# Altium schematic sheet llrf_afe_fpga_conf.SchDoc: =GlobalProjectName
size 209 x 297 mm; SheetNumber: Лист; SheetTotal: Листов; PageSetup: Record=PageOptions|CenterHorizontal=True|CenterVertical=True|PrintScale=1.00|XCorrection=1.00|YCorrection=1.00|PrintKind=1|BorderSize=5000000|LeftOffset=0|BottomOffset=0|Orientation=2|PaperLength=1000|PaperWidth=1000|Scale=100|PaperSource=15|PrintQuality=1200|MediaType=1|DitherType=10|PaperKind=A3|PrintScaleMode=1; Weight: -; ScaleFactor: -
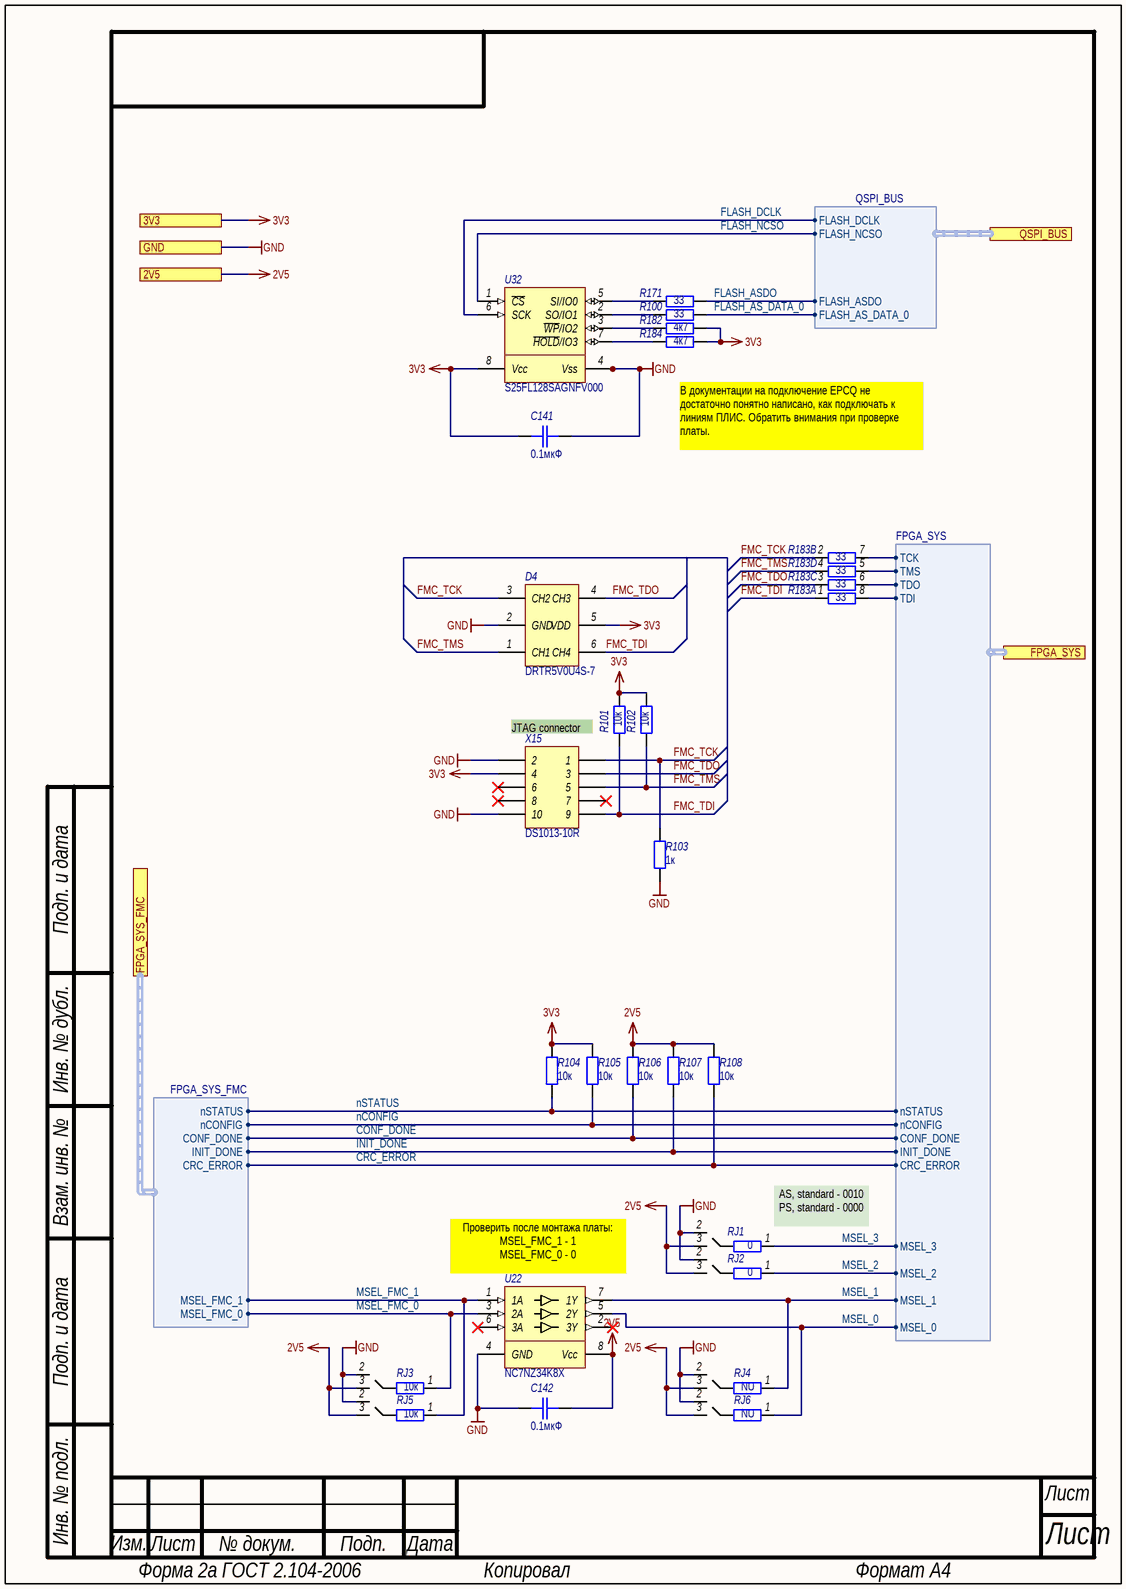
[diagram p0: llrf_afe_fpga_conf.SchDoc]

## Parts
C141  0.1мкФ  [SMD_C0402]
C142  0.1мкФ  [SMD_C0402]
D4  Наименование: DRTR5V0U4S-7  [SOT-363]  (hidden comment: DRTR5V0U4S)
R100  33  [SMD_0603]
R101  10к  [SMD_0603]
R102  10к  [SMD_0603]
R103  1к  [SMD_0603]
R104  10к  [SMD_0603]
R105  10к  [SMD_0603]
R106  10к  [SMD_0603]
R107  10к  [SMD_0603]
R108  10к  [SMD_0603]
R171  33  [SMD_0603]
R182  4к7  [SMD_0603]
R183  value 33  [TC124]  (hidden comment: 4 Chip Resistor Array)  (parts A,B,C,D of 4)
R184  4к7  [SMD_0603]
RJ1  0  [SMD_JMP_0603]
RJ2  0  [SMD_JMP_0603]
RJ3  10к  [SMD_JMP_0603]
RJ4  NU  [SMD_JMP_0603]
RJ5  10к  [SMD_JMP_0603]
RJ6  NU  [SMD_JMP_0603]
U22  Наименование: NC7NZ34K8X  [US-8]  (hidden comment: NC7NZ34)
U32  Наименование: S25FL128SAGNFV000  [WSON-8_6x8]  (hidden comment: S25FL128SAGN)
X15  DS1013-10R  [DS1013-10R]

## Ports
2V5, 3V3, FPGA_SYS (harness FPGA_SYS), FPGA_SYS_FMC (harness FPGA_SYS_FMC), GND, QSPI_BUS (harness QSPI_BUS)

## Harnesses
QSPI_BUS: FLASH_ASDO, FLASH_NCSO, FLASH_DCLK, FLASH_AS_DATA_0
FPGA_SYS: TCK, TMS, TDO, TDI, CRC_ERROR, INIT_DONE, nSTATUS, CONF_DONE, nCONFIG, MSEL_0, MSEL_1, MSEL_2, MSEL_3
FPGA_SYS_FMC: INIT_DONE, nSTATUS, CONF_DONE, nCONFIG, MSEL_FMC_0, MSEL_FMC_1, CRC_ERROR

## Nets
2V5: C142.2 R106.2 R107.2 R108.2 RJ1.3 RJ2.3 RJ3.3 RJ4.3 RJ5.3 RJ6.3 U22.8(Vcc) ; port 2V5
3V3: C141.2 D4.5(VDD) R101.2 R102.2 R104.2 R105.2 R182.1 R184.1 U32.8(Vcc) X15.4 ; port 3V3
GND: C141.1 C142.1 D4.2(GND) R103.1 RJ1.2 RJ2.2 RJ3.2 RJ4.2 RJ5.2 RJ6.2 U22.4(GND) U32.4(Vss) U32.9(TP) X15.2 X15.10 ; port GND
CONF_DONE: R106.1 ; port FPGA_SYS.CONF_DONE, port FPGA_SYS_FMC.CONF_DONE
CRC_ERROR: R108.1 ; port FPGA_SYS.CRC_ERROR, port FPGA_SYS_FMC.CRC_ERROR
FLASH_AS_DATA_0: R100.2 ; port QSPI_BUS.FLASH_AS_DATA_0
FLASH_ASDO: R171.2 ; port QSPI_BUS.FLASH_ASDO
FLASH_DCLK: U32.6(SCK) ; port QSPI_BUS.FLASH_DCLK
FLASH_NCSO: U32.1(~{CS}) ; port QSPI_BUS.FLASH_NCSO
FMC_TCK: D4.3(СH2) R103.2 R183.2 X15.1
FMC_TDI: D4.6(СH4) R101.1 R183.1 X15.9
FMC_TDO: D4.4(СH3) R183.3 X15.3
FMC_TMS: D4.1(СH1) R102.1 R183.4 X15.5
INIT_DONE: R107.1 ; port FPGA_SYS.INIT_DONE, port FPGA_SYS_FMC.INIT_DONE
MSEL_0: RJ6.1 U22.5(2Y) ; port FPGA_SYS.MSEL_0
MSEL_1: RJ4.1 U22.7(1Y) ; port FPGA_SYS.MSEL_1
MSEL_2: RJ2.1 ; port FPGA_SYS.MSEL_2
MSEL_3: RJ1.1 ; port FPGA_SYS.MSEL_3
MSEL_FMC_0: RJ3.1 U22.3(2A) ; port FPGA_SYS_FMC.MSEL_FMC_0
MSEL_FMC_1: RJ5.1 U22.1(1A) ; port FPGA_SYS_FMC.MSEL_FMC_1
nCONFIG: R105.1 ; port FPGA_SYS.nCONFIG, port FPGA_SYS_FMC.nCONFIG
nSTATUS: R104.1 ; port FPGA_SYS.nSTATUS, port FPGA_SYS_FMC.nSTATUS
NetR100_1: R100.1 U32.2(SO/IO1)
NetR171_1: R171.1 U32.5(SI/IO0)
NetR182_2: R182.2 U32.3(~{WP}/IO2)
NetR183_5: R183.5 ; port FPGA_SYS.TMS
NetR183_6: R183.6 ; port FPGA_SYS.TDO
NetR183_7: R183.7 ; port FPGA_SYS.TCK
NetR183_8: R183.8 ; port FPGA_SYS.TDI
NetR184_2: R184.2 U32.7(~{HOLD}/IO3)

Not connected (* = marked no-connect by the designer): U22 2(3Y)* 6(3A)*; X15 6* 7* 8*

## Notes on the sheet
- В документации на подключение EPCQ не достаточно понятно написано, как подключать к линиям ПЛИС. Обратить внимания при проверке платы.
- JTAG connector
- (near U22) Проверить после монтажа платы:
  MSEL_FMC_1 - 1
  MSEL_FMC_0 - 0
- (near RJ1) AS, standard - 0010
  PS, standard - 0000
- Подп. и дата
- Инв. № дубл.
- Взам. инв. №
- Инв. № подл.
- Изм.
- Лист
- № докум.
- Подп.
- Дата
- Форма 2а ГОСТ 2.104-2006
- Копировал
- Формат А4

## Library data of the parts
C141 C142 = Capacitor: Назначение: SMD-конденсатор; Наименование: Конденсатор; Потребление, Вт: 0; Value: 0.1мкФ
D4 = DRTR5V0U4S: 4 CHANNEL LOW CAPACITANCE TVS DIODE ARRAY; Потребление, Вт: 0.0; Назначение: 4 CHANNEL LOW CAPACITANCE TVS DIODE ARRAY; ComponentLink1Description: DataSheet; ComponentLink1URL: DRTR5V0U4S; Supplier 1: Digi-Key; Supplier Part Number 1: DRTR5V0U4S-7DICT-ND
R100 R171 = Resistor: PE1206DRM470R01L; Наименование: Резистор; Назначение: SMD-резистор; Потребление, Вт: 0,001; Value: 33
R101-R108 R182 R184 = Resistor: Наименование: Резистор; Назначение: SMD-резистор; Потребление, Вт: 0,001
  R101 R102 R104-R108: Value: 10к
  R103: Value: 1к
  R182 R184: Value: 4к7
R183 = Resistor-4: Потребление, Вт: 0.0; Наименование: TC124-FR-0733RL; Назначение: 4 Chip Resistor Array; Описание: TC124-FR-0733RL
RJ1-RJ6 = Resistor_Jamper: Resistor-Jumper; Назначение: Резистор для выбора режима; Наименование: Резистор; Потребление, Вт: 0,0
  RJ1 RJ2: Value: 0
  RJ3 RJ5: Value: 10к
  RJ4 RJ6: Value: NU
U22 = NC7NZ34: TinyLogic UHS Triple Buffer; Потребление, Вт: 0.01; Назначение: TinyLogic UHS Triple Buffer; ComponentLink1Description: DataSheet; ComponentLink1URL: https://www.onsemi.com/pdf/datasheet/nc7nz34-d.pdf; Supplier 1: Digi-Key; Supplier Part Number 1: NC7NZ34K8XCT-ND
U32 = S25FL128SAGN: Programmable NOR flash memory; Потребление, Вт: 0.1; Назначение: Programmable NOR flash memory
X15 = Header 2X10: Header, 10-Pin, Dual row; Потребление, Вт: 0,0; Назначение: Header, 10-Pin, Dual row; Наименование: DS1013-10R